# Altium schematic sheet MANEA_TCAD_PROIECT_Sheet2.SchDoc (part 3 of 3)
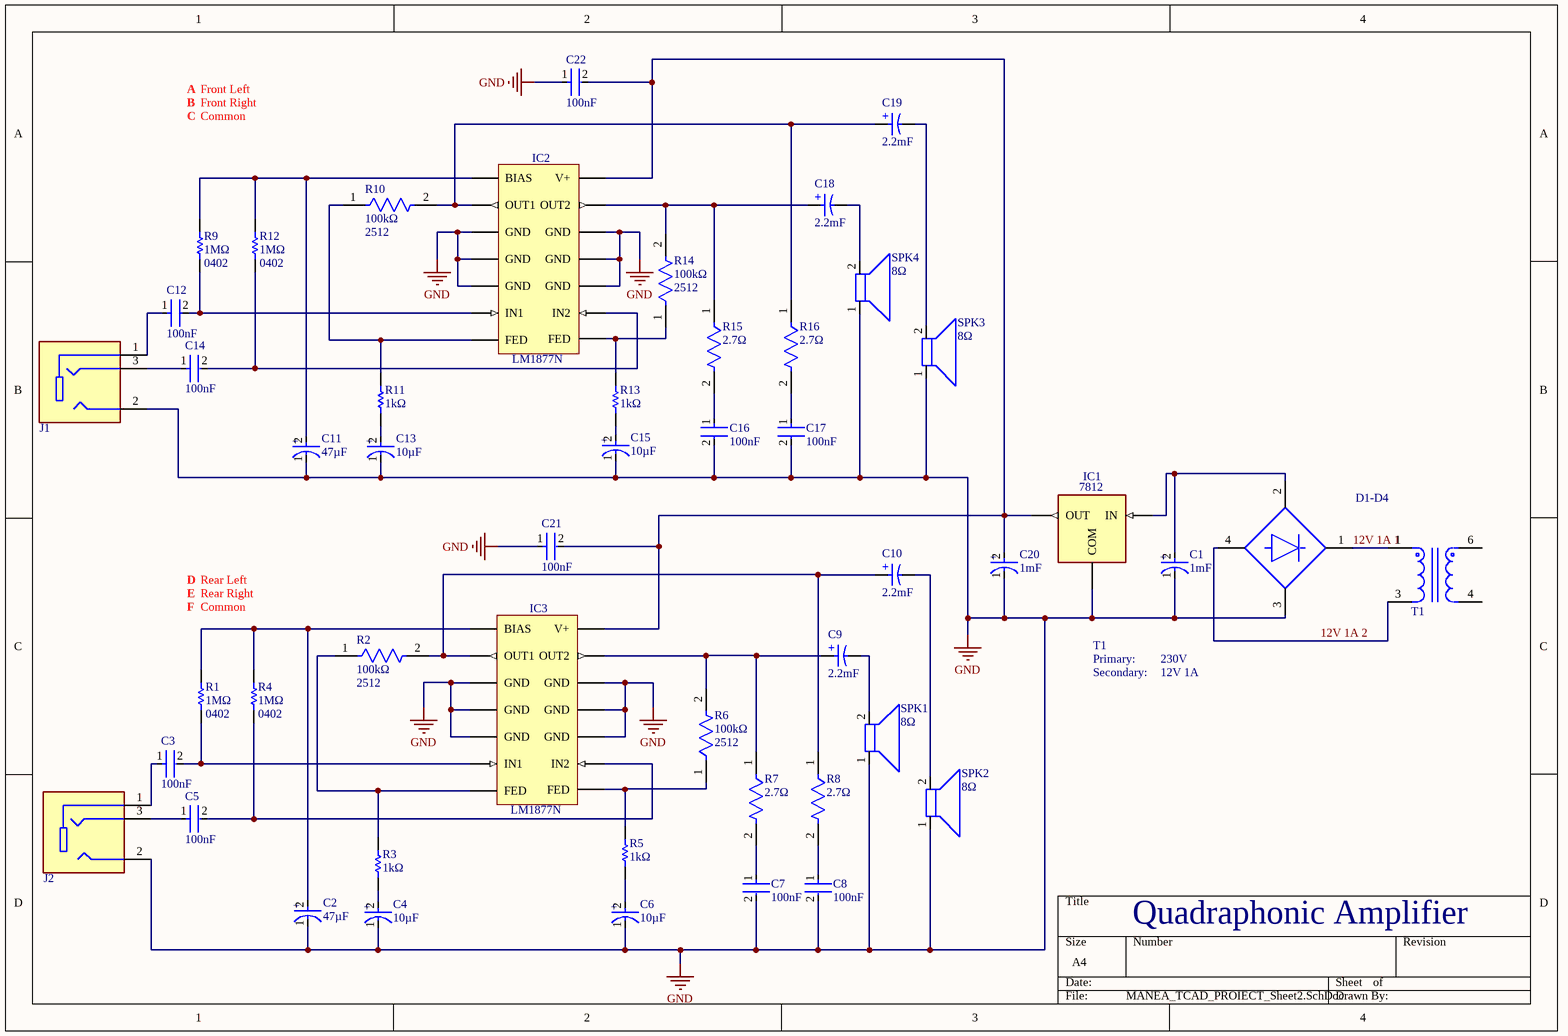
[diagram p2: MANEA_TCAD_PROIECT_Sheet2.SchDoc]

## Library data of the parts (continued)
R3 R5 R11 R13 = RC1206FR-071KL: 250mW Thick Film Resistors 200V ±100ppm/℃ ±1% 1kΩ 1206 Chip Resistor - Surface Mount ROHS; Manufacturer: Yageo Group; Temperature Coefficient: 100ppm/°C; Supplier: Farnell; Supplier Part Number: RC1206FR-071KL; Manufacturer Part Number: RC1206FR-071KL; RoHS: Compliant; Category: Chip SMD Resistors; Stock: 132012; Pricing: 500=500, 1000=0.05, 2500=0.05 (EUR); Case/Package: 1206; Case Code (Imperial): 1206; Case Code (Metric): 3216; China RoHS: Non-Compliant; Composition: Thick Film; Country of Origin: Mainland China, Taiwan; Depth: 1.6mm; Export Control Classification Number (ECCN) Code: EAR99; Height: 550µm; Harmonized Tariff Schedule (HTS) Code: 8533.21.00.30; Introduction Date: 2008-07-18; Lead Free: Lead Free; Length: 3.1mm; Lifecycle Status: Production; Max Operating Temperature: 155°C; Military Standard: Not; Min Operating Temperature: -55°C; Mounting Technology: Surface Mount; Pins: 2; Number of Terminals: 2; Packaging: Tape & Reel; Power Dissipation: 250mW; Power Rating: 250mW; REACH SVHC: Yes; Schedule B: 8533210045, 8533210045|8533210045, 8533210045|8533210045|8533210045, 8533210045|8533210045|8533210045|8533210045; Termination: SMD/SMT; Tolerance: 1%; Voltage Rating: 200V; Voltage Rating (AC): 200V; Voltage Rating (DC): 200V; Width: 1.6mm; Working Voltage: 200V; ComponentLink1URL: https://datasheet.octopart.com:443/RC1206FR-071KL-Yageo-datasheet-175887523.pdf?src-supplier=Newark; ComponentLink1Description: https://datasheet.octopart.com:443/RC1206FR-071KL-Yageo-datasheet-175887523.pdf?src-supplier=Newark; ComponentLink2URL: https://datasheet.octopart.com:443/RC1206FR-071KL-Yageo-datasheet-103092701.pdf?src-supplier=Upverter; ComponentLink2Description: https://datasheet.octopart.com:443/RC1206FR-071KL-Yageo-datasheet-103092701.pdf?src-supplier=Upverter; ComponentLink3URL: https://datasheet.octopart.com:443/RC1206FR-071KL-Yageo-datasheet-98239111.pdf?src-supplier=Upverter; ComponentLink3Description: https://datasheet.octopart.com:443/RC1206FR-071KL-Yageo-datasheet-98239111.pdf?src-supplier=Upverter; ComponentLink4URL: https://datasheet.octopart.com:443/RC1206FR-071KL-Yageo-datasheet-8359522.pdf?src-supplier=element14+APAC; ComponentLink4Description: https://datasheet.octopart.com:443/RC1206FR-071KL-Yageo-datasheet-8359522.pdf?src-supplier=element14+APAC; ComponentLink5URL: https://datasheet.octopart.com:443/RC1206FR-071KL-Yageo-datasheet-13032847.pdf?src-supplier=element14+APAC; ComponentLink5Description: https://datasheet.octopart.com:443/RC1206FR-071KL-Yageo-datasheet-13032847.pdf?src-supplier=element14+APAC; ComponentLink6URL: https://datasheet.octopart.com:443/RC1206FR-071KL-Yageo-datasheet-62067350.pdf?src-supplier=Farnell; ComponentLink6Description: https://datasheet.octopart.com:443/RC1206FR-071KL-Yageo-datasheet-62067350.pdf?src-supplier=Farnell; ComponentLink7URL: https://datasheet.octopart.com:443/RC1206FR-071KL-Yageo-Group-datasheet-176638170.pdf?src-supplier=Future+Electronics; ComponentLink7Description: https://datasheet.octopart.com:443/RC1206FR-071KL-Yageo-Group-datasheet-176638170.pdf?src-supplier=Future+Electronics; ComponentLink8URL: https://datasheet.octopart.com:443/RC1206FR-071KL-Yageo-datasheet-164759695.pdf?src-supplier=Future+Electronics; ComponentLink8Description: https://datasheet.octopart.com:443/RC1206FR-071KL-Yageo-datasheet-164759695.pdf?src-supplier=Future+Electronics; ComponentLink9URL: https://datasheet.octopart.com:443/RC1206FR-071KL-Yageo-datasheet-137700087.pdf?src-supplier=Future+Electronics; ComponentLink9Description: https://datasheet.octopart.com:443/RC1206FR-071KL-Yageo-datasheet-137700087.pdf?src-supplier=Future+Electronics; ComponentLink10URL: https://datasheet.octopart.com:443/RC1206FR-071KL-Yageo-datasheet-27233761.pdf?src-supplier=Future+Electronics; ComponentLink10Description: https://datasheet.octopart.com:443/RC1206FR-071KL-Yageo-datasheet-27233761.pdf?src-supplier=Future+Electronics; ComponentLink11URL: https://datasheet.octopart.com:443/RC1206FR-071KL-Yageo-datasheet-8324387.pdf?src-supplier=Future+Electronics; ComponentLink11Description: https://datasheet.octopart.com:443/RC1206FR-071KL-Yageo-datasheet-8324387.pdf?src-supplier=Future+Electronics; ComponentLink12URL: https://datasheet.octopart.com:443/RC1206FR-071KL-Yageo-datasheet-79472498.pdf?src-supplier=Megastar; ComponentLink12Description: https://datasheet.octopart.com:443/RC1206FR-071KL-Yageo-datasheet-79472498.pdf?src-supplier=Megastar; ComponentLink13URL: https://datasheet.octopart.com/RC1206FR-071KL-Yageo-datasheet-73766026.pdf; ComponentLink13Description: https://datasheet.octopart.com/RC1206FR-071KL-Yageo-datasheet-73766026.pdf; ComponentLink14URL: https://datasheet.octopart.com:443/RC1206FR-071KL-Yageo-datasheet-118639.pdf?src-supplier=DigiKey; ComponentLink14Description: https://datasheet.octopart.com:443/RC1206FR-071KL-Yageo-datasheet-118639.pdf?src-supplier=DigiKey; ComponentLink15URL: http://sigma.octopart.com:80/conflict_mineral_statement/Yageo-company-3.pdf?src-supplier=Compliance+Statements; ComponentLink15Description: http://sigma.octopart.com:80/conflict_mineral_statement/Yageo-company-3.pdf?src-supplier=Compliance+Statements; ComponentLink16URL: http://sigma.octopart.com:80/rohs_statement/Yageo-company-2.pdf?src-supplier=Compliance+Statements; ComponentLink16Description: http://sigma.octopart.com:80/rohs_statement/Yageo-company-2.pdf?src-supplier=Compliance+Statements
R7 R8 R15 R16 = CR0402-J/-2R7GLF: CR0402 FIXED RESISTOR 0402 (1005Metric) Chip Resistor ±5% -250/ +500ppm/C 2.7Ohm 0.063W 1/16W; Manufacturer: Bourns; Max Power Dissipation: 63mW; Power Rating: 62.5mW; Temperature Coefficient: 500ppm/°C; Voltage Rating: 50V; Supplier: DigiKey; Supplier Part Number: CR0402-J/-2R7GLFDKR-ND; Manufacturer Part Number: CR0402-J/-2R7GLF; RoHS: Compliant; Category: Chip SMD Resistors; Pricing: 1=0.1, 10=0.02, 25=0.0144, 50=0.0114, 100=0.0091, 250=0.00696, 500=0.00574, 1000=0.0048, 5000=0.00333 (USD); Case/Package: 0402; Case Code (Imperial): 0402; Case Code (Metric): 1005; China RoHS: Non-Compliant; Composition: Thick Film; Contact Plating: Tin; Country of Origin: Taiwan; Depth: 500µm; Export Control Classification Number (ECCN) Code: EAR99; Height: 320µm; Harmonized Tariff Schedule (HTS) Code: 8533.21.00.30; Introduction Date: 2003-04-07; Length: 1mm; Lifecycle Status: Production; Max Operating Temperature: 155°C; Military Standard: Not; Min Operating Temperature: -55°C; Mounting Technology: Surface Mount; Number of Terminals: 2; Power Dissipation: 63mW; Radiation Hardening: No; REACH SVHC: Yes; Termination: SMD/SMT; Tolerance: 5%; Width: 500µm; Working Voltage: 50V; ComponentLink1URL: https://datasheet.octopart.com:443/CR0402-J--2R7GLF-Bourns-datasheet-159578630.pdf?src-supplier=IHS; ComponentLink1Description: https://datasheet.octopart.com:443/CR0402-J--2R7GLF-Bourns-datasheet-159578630.pdf?src-supplier=IHS; ComponentLink2URL: https://datasheet.octopart.com:443/CR0402-J--2R7GLF-Bourns-datasheet-181955239.pdf?src-supplier=IHS; ComponentLink2Description: https://datasheet.octopart.com:443/CR0402-J--2R7GLF-Bourns-datasheet-181955239.pdf?src-supplier=IHS; ComponentLink3URL: https://datasheet.octopart.com:443/CR0402-J--2R7GLF-Bourns-datasheet-68301632.pdf?src-supplier=Electro+Sonic; ComponentLink3Description: https://datasheet.octopart.com:443/CR0402-J--2R7GLF-Bourns-datasheet-68301632.pdf?src-supplier=Electro+Sonic; ComponentLink4URL: https://datasheet.octopart.com/CR0402-J/-2R7GLF-Bourns-datasheet-8723995.pdf; ComponentLink4Description: https://datasheet.octopart.com/CR0402-J/-2R7GLF-Bourns-datasheet-8723995.pdf; ComponentLink5URL: http://sigma.octopart.com:80/conflict_mineral_statement/Bourns-company-36.pdf?src-supplier=Compliance+Statements; ComponentLink5Description: http://sigma.octopart.com:80/conflict_mineral_statement/Bourns-company-36.pdf?src-supplier=Compliance+Statements
SPK1-SPK4 = ASE02808MR-LW150-R: Speakers & Transducers 28mm SPEAKER w/ENCL 2 W 8 OHM 82 DB; Manufacturer: PUI Audio; Cable Length: 150mm; Max Power Dissipation: 3W; Power Rating: 2W; Self Resonant Frequency: 22Hz; Shape: Rectangular, Square; Supplier: DigiKey; Supplier Part Number: 668-1431-ND; RoHS: Compliant; Category: Speakers; Stock: 2641; Pricing: 1=7.56, 10=5.802, 42=4.95976, 84=4.60714, 126=4.41524, 252=4.10972, 504=3.83006, 1008=3.65106 (USD); Height: 14.8mm; Length: 31mm; Mounting Technology: Flanges; REACH SVHC: Yes; Termination: Wire Leads; Width: 28mm; ComponentLink1URL: https://datasheet.octopart.com:443/ASE02808MR-LW150-R-PUI-Audio-datasheet-128089182.pdf?src-supplier=JRH+Electronics; ComponentLink1Description: https://datasheet.octopart.com:443/ASE02808MR-LW150-R-PUI-Audio-datasheet-128089182.pdf?src-supplier=JRH+Electronics; ComponentLink2URL: https://datasheet.octopart.com:443/ASE02808MR-LW150-R-PUI-Audio-datasheet-128089185.pdf?src-supplier=Sager+Electronics; ComponentLink2Description: https://datasheet.octopart.com:443/ASE02808MR-LW150-R-PUI-Audio-datasheet-128089185.pdf?src-supplier=Sager+Electronics; Manufacturer Part Number: ASE02808MR-LW150-R
T1 = PE-68386NL: Pulse Transformer 1: 1 1500VDC 0.6Ohm Prim. DCR 0.6Ohm Sec. DCR 6 Terminal SMD Automotive; Manufacturer: Yageo Group; DC Resistance (DCR): 600mΩ; Value: 785µH; Isolation Voltage: 1500Vrms; Number of Circuits: 1; Shielding: Unshielded; Turns Ratio: 1:1; Supplier: Farnell; Supplier Part Number: PE-68386NL; Manufacturer Part Number: PE-68386NL; RoHS: Compliant; Category: Transformers; Stock: 604; Pricing: 1=1, 10=8.84, 25=8.53, 50=7.92, 100=7.32, 500=7.16 (EUR); Case/Package: SMD/SMT; Country of Origin: Mainland China; Depth: 8.64mm; Export Control Classification Number (ECCN) Code: EAR99; Height: 2.5mm; Introduction Date: 1998-06-30; Length: 8.6mm; Lifecycle Status: Production; Max Operating Temperature: 130°C; Min Operating Temperature: -40°C; Mounting Technology: Surface Mount; Pins: 6; Radiation Hardening: No; REACH SVHC: Yes; Schedule B: 8504500000, 8504500000|8504500000, 8504500000|8504500000|8504500000, 8504500000|8504500000|8504500000|8504500000; Termination: SMD/SMT; Width: 6.7mm; ComponentLink1URL: https://datasheet.octopart.com:443/PE-68386NL-Pulse-datasheet-155502643.pdf?src-supplier=Upverter; ComponentLink1Description: https://datasheet.octopart.com:443/PE-68386NL-Pulse-datasheet-155502643.pdf?src-supplier=Upverter; ComponentLink2URL: https://datasheet.octopart.com:443/PE-68386NL-Pulse-datasheet-151940171.pdf?src-supplier=IHS; ComponentLink2Description: https://datasheet.octopart.com:443/PE-68386NL-Pulse-datasheet-151940171.pdf?src-supplier=IHS; ComponentLink3URL: https://datasheet.octopart.com:443/PE-68386NL-Pulse-datasheet-134530794.pdf?src-supplier=ODG+(Origin+Data+Global); ComponentLink3Description: https://datasheet.octopart.com:443/PE-68386NL-Pulse-datasheet-134530794.pdf?src-supplier=ODG+(Origin+Data+Global); ComponentLink4URL: https://datasheet.octopart.com:443/PE-68386NL-Pulse-datasheet-8399838.pdf?src-supplier=Factory+Futures; ComponentLink4Description: https://datasheet.octopart.com:443/PE-68386NL-Pulse-datasheet-8399838.pdf?src-supplier=Factory+Futures; ComponentLink5URL: https://datasheet.octopart.com:443/PE-68386NL-Pulse-datasheet-145346898.pdf?src-supplier=Future+Electronics; ComponentLink5Description: https://datasheet.octopart.com:443/PE-68386NL-Pulse-datasheet-145346898.pdf?src-supplier=Future+Electronics; ComponentLink6URL: http://sigma.octopart.com:80/conflict_mineral_statement/Yageo-company-3.pdf?src-supplier=Compliance+Statements; ComponentLink6Description: http://sigma.octopart.com:80/conflict_mineral_statement/Yageo-company-3.pdf?src-supplier=Compliance+Statements; ComponentLink7URL: http://sigma.octopart.com:80/rohs_statement/Yageo-company-2.pdf?src-supplier=Compliance+Statements; ComponentLink7Description: http://sigma.octopart.com:80/rohs_statement/Yageo-company-2.pdf?src-supplier=Compliance+Statements